# Altium schematic sheet InputConnectors.SchDoc
size A4; SheetNumber: 3; SheetTotal: 22
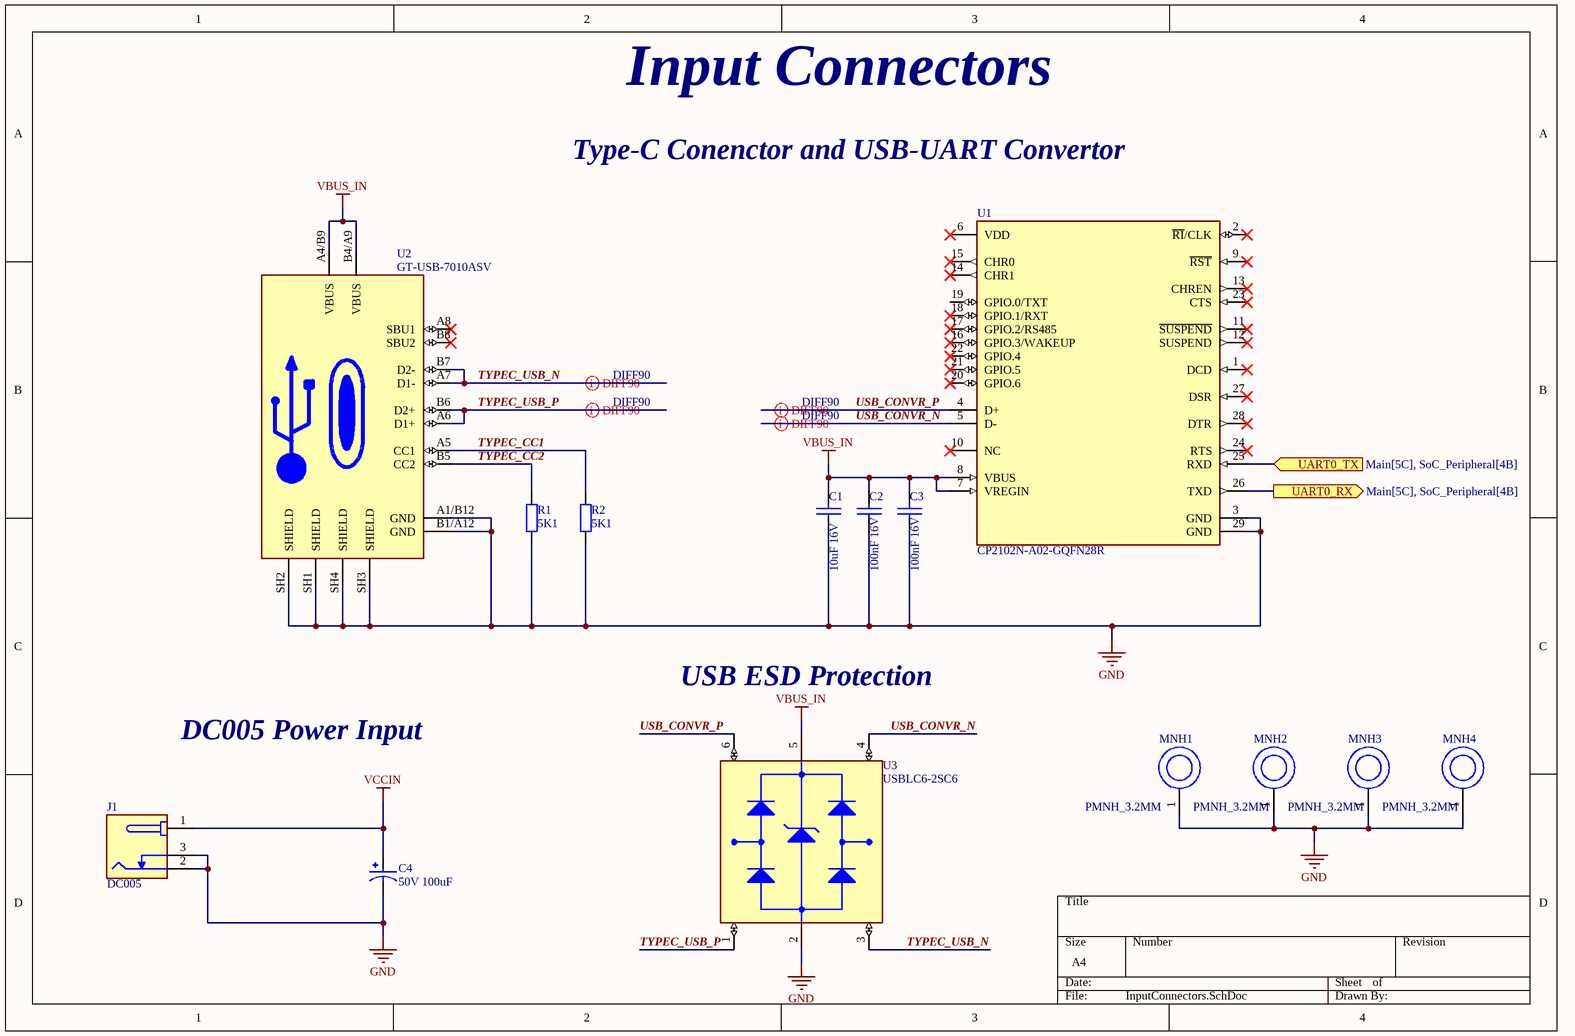
[diagram p0: InputConnectors.SchDoc]

## Parts
C1  10uF 16V  [C_0603]
C2  100nF 16V  [C_0402]
C3  100nF 16V  [C_0402]
C4  50V 100uF  [CAP_D6.3xL7.7mm]
J1  DC005  [DC005]
MNH1  PMNH_3.2MM  [PMNH_3.2MM]
MNH2  PMNH_3.2MM  [PMNH_3.2MM]
MNH3  PMNH_3.2MM  [PMNH_3.2MM]
MNH4  PMNH_3.2MM  [PMNH_3.2MM]
R1  5K1  [R_0603]
R2  5K1  [R_0603]
U1  CP2102N-A02-GQFN28R  [FP-CP2102N-A02-GQFN28R-MFG]
U2  GT-USB-7010ASV  [GT-USB-7010ASV]
U3  USBLC6-2SC6  [SOT-23-6]

## Ports
UART0_RX (out, see Main[5C], SoC_Peripheral[4B]), UART0_TX (in, see Main[5C], SoC_Peripheral[4B])

## Nets
GND: C1.2 C2.2 C3.2 C4.2 J1.2 J1.3 MNH1.1 MNH2.1 MNH3.1 MNH4.1 R1.1 R2.1 U1.3(GND) U1.29(GND) U2.A1/B12(GND) U2.B1/A12(GND) U2.SH1(SHIELD) U2.SH2(SHIELD) U2.SH3(SHIELD) U2.SH4(SHIELD) U3.2(GND)
VBUS_IN: C1.1 C2.1 C3.1 U1.7(VREGIN) U1.8(VBUS) U2.A4/B9(VBUS) U2.B4/A9(VBUS) U3.5(VBUS)
VCCIN: C4.1 J1.1
TYPEC_CC1: R2.2 U2.A5(CC1)
TYPEC_CC2: R1.2 U2.B5(CC2)
TYPEC_USB_N: U2.A7(D1-) U2.B7(D2-) U3.3(I/O2_IN)
TYPEC_USB_P: U2.A6(D1+) U2.B6(D2+) U3.1(I/O1_IN)
UART0_RX: U1.26(TXD) ; port UART0_RX
UART0_TX: U1.25(RXD) ; port UART0_TX
USB_CONVR_N: U1.5(D-) U3.4(I/O2_OUT)
USB_CONVR_P: U1.4(D+) U3.6(I/O1_OUT)

Not connected (* = marked no-connect by the designer): U1 1(DCD)* 2(~{RI}/CLK)* 6(VDD)* 9(~{RST})* 10(NC)* 11(~{SUSPEND})* 12(SUSPEND)* 13(CHREN)* 14(CHR1)* 15(CHR0)* 16(GPIO.3/WAKEUP)* 17(GPIO.2/RS485)* 18(GPIO.1/RXT)* 19(GPIO.0/TXT) 20(GPIO.6)* 21(GPIO.5)* 22(GPIO.4)* 23(CTS)* 24(RTS)* 27(DSR)* 28(DTR)*; U2 A8(SBU1)* B8(SBU2)*

## Layout directives
differential pair; differential pair class DIFF90: TYPEC_USB_N, TYPEC_USB_P, USB_CONVR_N, USB_CONVR_P

## Notes on the sheet
- Input Connectors
- Type-C Conenctor and USB-UART Convertor
- USB ESD Protection
- DC005 Power Input

## Library data of the parts
C1 = C_0603: Capacitor 0603 SMD
C2 C3 = C_0402: Capacitor 0402 SMD
C4 = RVT1H101M0607: 100uF 50V 229mA@120Hz ±20% SMD,D6.3xL7.7mm Aluminum Electrolytic Capacitors - SMD ROHS; Manudacturer: ROQANG; Manufacturer Part Number: RVT1H101M0607; Datasheet Link: https://www.lcsc.com/datasheet/lcsc_datasheet_2410121458_ROQANG-RVT1H101M0607_C3151829.pdf
J1 = DC005: Bend-in DC Power Receptacle -20℃~+70℃ 2mm 6.3mm 5A 24V Plugin DC Power Connectors ROHS
R1 R2 = R_0603: Resistor 0603 SMD
U1 = CMP-08093-000007-1: IC USB TO UART BRIDGE QFN28
U2 = GT-USB-7010ASV: USB 2.0 3A 1 Horizontal attachment 16P Female -40℃~+85℃ Type-C SMD USB Connectors ROHS; Manufacturer: G-Switch; Manufacturer Part Number: GT-USB-7010ASV; ComponentLink1Description: Datasheet Link; ComponentLink1URL: https://www.lcsc.com/datasheet/lcsc_datasheet_2411221125_G-Switch-GT-USB-7010ASV_C2988369.pdf
U3 = USBLC6-2SC6: 6A 12V 150W 6V Unidirectional 5V SOT-23-6 ESD and Surge Protection (TVS/ESD) ROHS; Manufacturer: STMicroelectronics; Manufacturer Part Number: USBLC6-2SC6; Datasheet Link: https://www.st.com/resource/en/datasheet/usblc6-2.pdf